# Altium project StarTopper.PrjPcb
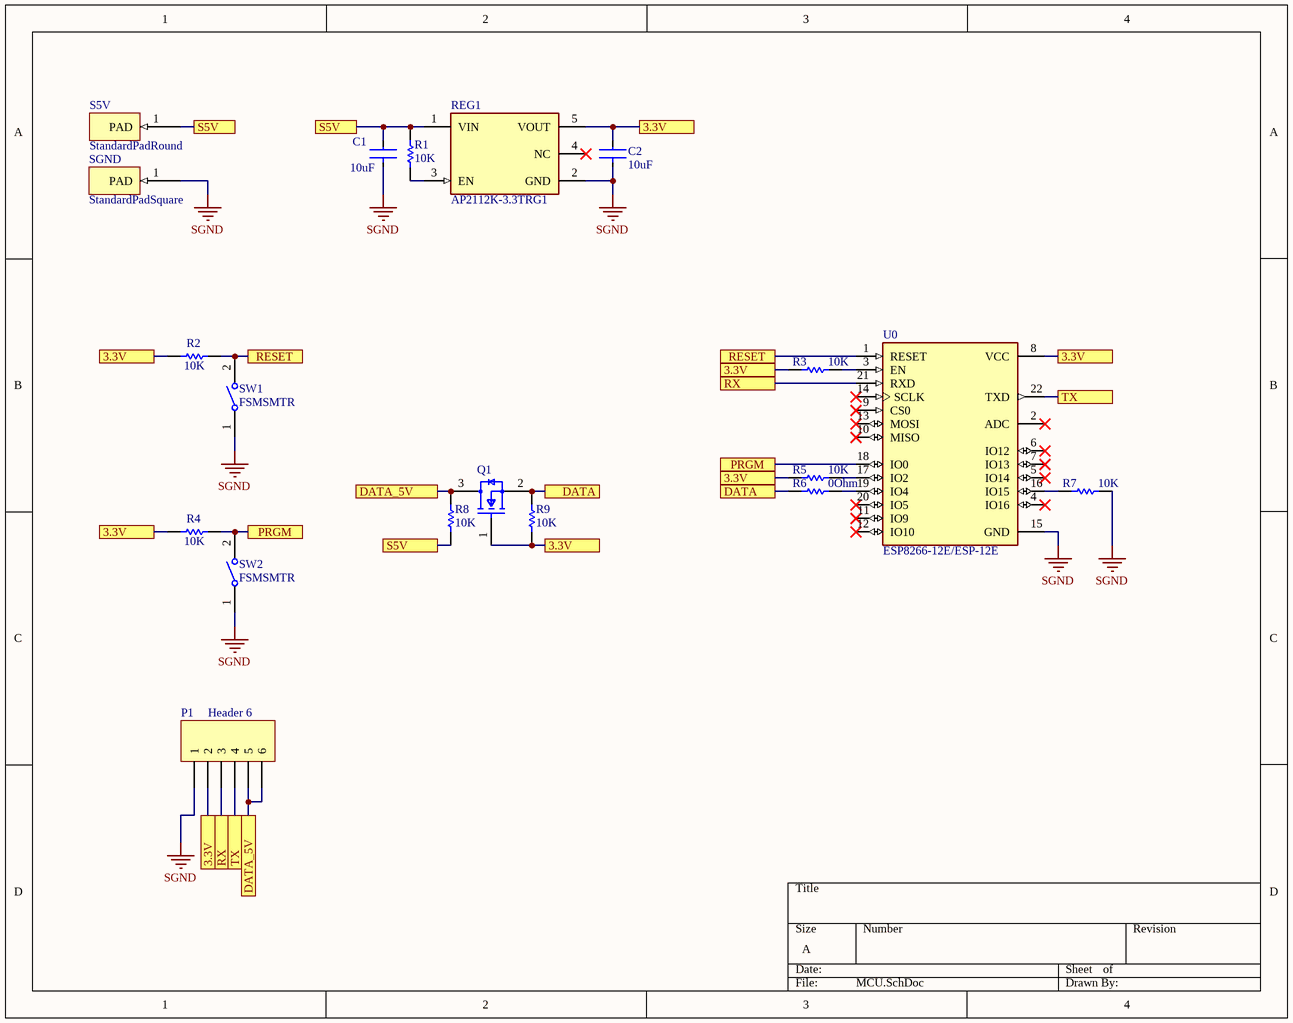
[diagram p0: MCU.SchDoc]
2 sheets, 86 parts. Net scope: flat (ports and power ports of the same name join across sheets).
Board file: Star.PcbDoc
Sheets:
  MCU.SchDoc
  LEDs.SchDoc

## Sheet MCU.SchDoc
size A

### Parts
C1  value 10uF  [FP-CC0805-0_85-MFG]  (hidden comment: CC0805KKX7R6BB105)
C2  value 10uF  [FP-CC0805-0_85-MFG]  (hidden comment: CC0805KKX7R6BB105)
P1  Header 6  [HDR1X6]
Q1  BSS138  [FP-318-08-IPC_B]  (value not drawn)
R1  value 10K  [RESC2013X50X30LL20T20]  (hidden comment: CRCW08050000Z0EA)
R2  value 10K  [RESC2013X50X30LL20T20]  (hidden comment: CRCW08050000Z0EA)
R3  value 10K  [RESC2013X50X30LL20T20]  (hidden comment: CRCW08050000Z0EA)
R4  value 10K  [RESC2013X50X30LL20T20]  (hidden comment: CRCW08050000Z0EA)
R5  value 10K  [RESC2013X50X30LL20T20]  (hidden comment: CRCW08050000Z0EA)
R6  value 0Ohm  [RESC2013X50X30LL20T20]  (hidden comment: CRCW08050000Z0EA)
R7  value 10K  [RESC2013X50X30LL20T20]  (hidden comment: CRCW08050000Z0EA)
R8  10K  [RESC2013X50X30ML20T20]
R9  10K  [RESC2013X50X30ML20T20]
REG1  AP2112K-3.3TRG1  [FP-SOT25-IPC_A]
S5V  StandardPadRound  [StandardPadRound-Footprint-1]
SGND  StandardPadSquare  [StandardPadSquare-Footprint-1]
SW1  FSMSMTR  [TECO-FSMSMTR_V]
SW2  FSMSMTR  [TECO-FSMSMTR_V]
U0  ESP8266-12E/ESP-12E  [XCVR_ESP8266-12E%2FESP-12E]

### Ports
3.3V, DATA, DATA_5V, PRGM, RESET, RX, S5V, TX

### Nets
SGND: C1.1 C2.1 P1.1 R7.2 REG1.2(GND) SGND.1(PAD) SW1.1 SW2.1 U0.15(GND)
NetC1_2: C1.2 R1.2 R8.1 REG1.1(VIN) S5V.1(PAD) ; port S5V
NetC2_2: C2.2 P1.2 Q1.1(G) R2.1 R3.1 R4.1 R5.1 R9.1 REG1.5(VOUT) U0.8(VCC) ; port 3.3V
NetP1_3: P1.3 U0.21(RXD) ; port RX
NetP1_4: P1.4 U0.22(TXD) ; port TX
NetP1_5: P1.5 P1.6 Q1.3(D) R8.2 ; port DATA_5V
NetQ1_2: Q1.2(S) R6.1 R9.2 ; port DATA
NetR1_1: R1.1 REG1.3(EN)
NetR2_2: R2.2 SW1.2 U0.1(RESET) ; port RESET
NetR3_2: R3.2 U0.3(EN)
NetR4_2: R4.2 SW2.2 U0.18(IO0) ; port PRGM
NetR5_2: R5.2 U0.17(IO2)
NetR6_2: R6.2 U0.19(IO4)
NetR7_1: R7.1 U0.16(IO15)

Not connected (* = marked no-connect by the designer): REG1 4(NC)*; U0 2(ADC)* 4(IO16)* 5(IO14)* 6(IO12)* 7(IO13)* 9(CS0)* 10(MISO)* 11(IO9)* 12(IO10)* 13(MOSI)* 14(SCLK)* 20(IO5)*

### Library data of the parts
C1 C2 = CMP-03422-000182-1: CAP CER 1UF 10V X7R 0805; Manufacturer: Yageo; Material: Ceramic; Tolerance: 0.1; ComponentLink2URL: http://www.yageo.com/documents/recent/UPY-GPHC_Y5V_6.3V-to-50V_8.pdf; Automotive: No; Temperature Range Low: -30°C; Octopart: https://octopart.com/cc0805kkx7r6bb105-yageo-42522859; Temperature Characteristic: X7R; RoHS: TRUE; Voltage Rating: 10 V; Capacitance: 1 uF; Package: CC0805-0.85; Device Class L3: Ceramic Capacitors; Category: Cap; Mouser Description: Multilayer Ceramic Capacitors MLCC - SMD/SMT 1.0uF 10V X7R 10%; Temperature Range High: +85°C; Ipc Land Pattern Name: CAPC200125X85; Manufacturer Part Number: CC0805KKX7R6BB105; ComponentLink2Description: Datasheet; Temperature: -30°C to +85°C; Height: 0.95mm; Lead Free: Yes; Device Class L1: Passive Components; Device Class L2: Capacitors; Footprint Url: http://www.yageo.com/exep/pages/download/literatures/UPY-C_GEN_24.pdf; Digikey Description: CAP CER 1UF 10V X7R 0805
P1 = CMP-049-0107-1: Header, 6-Pin; Signal Integrity: Connector; LatestRevisionNote: Re-released for DXP Platform.; LatestRevisionDate: 17-Jul-2002; Design Item ID: Header 6; Pin Count: 6; Publisher: Altium Limited; Source: Miscellaneous Connectors.SchLib; Component Type: Standard
Q1 = CMP-07173-000101-1: MOSFET N-CH 50V 220MA SOT-23; Turn-Off Delay Time: 20ns; Element Configuration: Single; Rds On Max: 3.5R; Gate to Source Voltage (Vgs): 20V; Threshold Voltage: 1.3V; Number of Elements: 1; Power Dissipation: 360mW; Rise Time: 9ns; Turn-On Delay Time: 2.5ns; Input Capacitance: 27pF; On-State Resistance: 6R; Lead Free: Lead Free; Length: 2.92mm; Width: 1.3mm; Drain to Source Breakdown Voltage: 50V; Min Operating Temperature: -55°C; REACH SVHC: No SVHC; Packaging: Tape and Reel; Radiation Hardening: No; Height: 0.93mm; Drain to Source Voltage (Vdss): 50V; Current Rating: 220mA; Voltage Rating (DC): 50V; Weight: 0.03g; Continuous Drain Current (ID): 220mA; Number of Pins: 3; Nominal Vgs: 1.3V; Max Power Dissipation: 360mW; Fall Time: 9ns; Drain to Source Resistance: 3.5R; Contact Plating: Tin; Case/Package: SOT-23; Package Quantity: 1; Dual Supply Voltage: 50V; Mount: Surface Mount; Termination: SMD/SMT; Max Operating Temperature: 150°C
R1-R7 = CMP-2001-04896-1: 0805; Manufacturer: Vishay Dale; Part Number: CRCW08050000Z0EA
R8 R9 = CMP-2001-03735-1: Part Number: CRCW0805270RFKEA; Manufacturer: Vishay Dale
REG1 = CMP-12756-000035-1: IC REG LINEAR 3.3V 600MA SOT25; Number of Regulators: 1; Output Type: Fixed; Polarity: Positive; Min Input Voltage: 2.5V; Max Input Voltage: 6V; Accuracy: 1.5%; Quiescent Current: 55uA; Dropout Voltage: 250mV; Min Operating Temperature: -40°C; Length: 3.1mm; Output Current: 600mA; Max Operating Temperature: 85°C; Package Quantity: 1; Output Voltage: 3.3V; Width: 1.7mm; Number of Outputs: 1; Packaging: Tape and Reel; Height: 1.3mm; Lead Free: Lead Free; Max Output Current: 600mA; Case/Package: SOT-23-5; Mount: Surface Mount; Number of Pins: 5
S5V = CMP-000003-1: 1.9mm x 1.9mm round pad with a 1mm hole
SGND = CMP-000004-1: 1.9mm X 1.9mm square pad with 1mm hole
SW1 SW2 = CMP-2000-07501-1: FSMSM Push Button Switch, 50 mA, -35 to 85 degC, 2-Pin SMD, RoHS, Tape and Reel; Manufacturer: TE Connectivity; Voltage Rating (DC): 24V; Electrical Life: 20000Cycles; Operating Force: 180gf; Switch Travel: 0.25mm; Contact Current Rating: 50mA; Case\/Package: SMD/SMT; Actuator Length: 1.07mm; Throw Configuration: SPST; Actuator Material: Polyamide; Contact Resistance: 100mOhm; Illumination Type: Illuminated; Max Voltage Rating (DC): 12V; Manufacturer URL: http://www.te.com/; Lead Free: LeadFree; Packaging: TapeandReel; Min Operating Temperature: -35degC; Mechanical Life: 20000Cycles; Mount: SurfaceMount; REACH SVHC: Unknown; Package Quantity: 1800; Package Reference: FSMSMTR; RoHSCompliant: true; Max Operating Temperature: 85degC; Orientation: Straight; ELV: Compliant; Datasheet URL: http://www.te.com/commerce/DocumentDelivery/DDEController?Action=showdoc&DocId=Customer+Drawing%7F1437566-3%7FC2%7Fpdf%7FEnglish%7FENG_CD_1437566-3_C2_1437566_3_1_c.dwg.pdf%7F1437566-4; Package Description: 2-Pin Surface Mount Device, Body 6 x 3.5 mm, Pitch 9.19 mm; Current Rating: 50mA; Contact Plating: Silver; Termination: GullWing; Datasheet Version: Rev. C2, 08/2014; Contact Material: Brass; Mounting Technology: SurfaceMount
U0 = CMP-052-0000-2: This WiFi module has a 32-bit MCU micro and clock speeds supporting 80 MHz or 160 MHz. Supports the RTOS and integrated Wi-Fi MAC/BB/RF/PA/LNA, and has an on-board antenna.; MF: AI-Thinker; Design Item ID: ESP8266-12E/ESP-12E; Availability: Unavailable; Source: SnapEDAsch.SchLib; SnapEDA_Link: https://www.snapeda.com/parts/ESP8266-12E/ESP-12E/AI-Thinker/view-part/106414/?ref=snap; Value: *; Component Type: Standard; Price: None; Pin Count: 22; Package: None; MP: ESP8266-12E/ESP-12E

## Sheet LEDs.SchDoc
size B
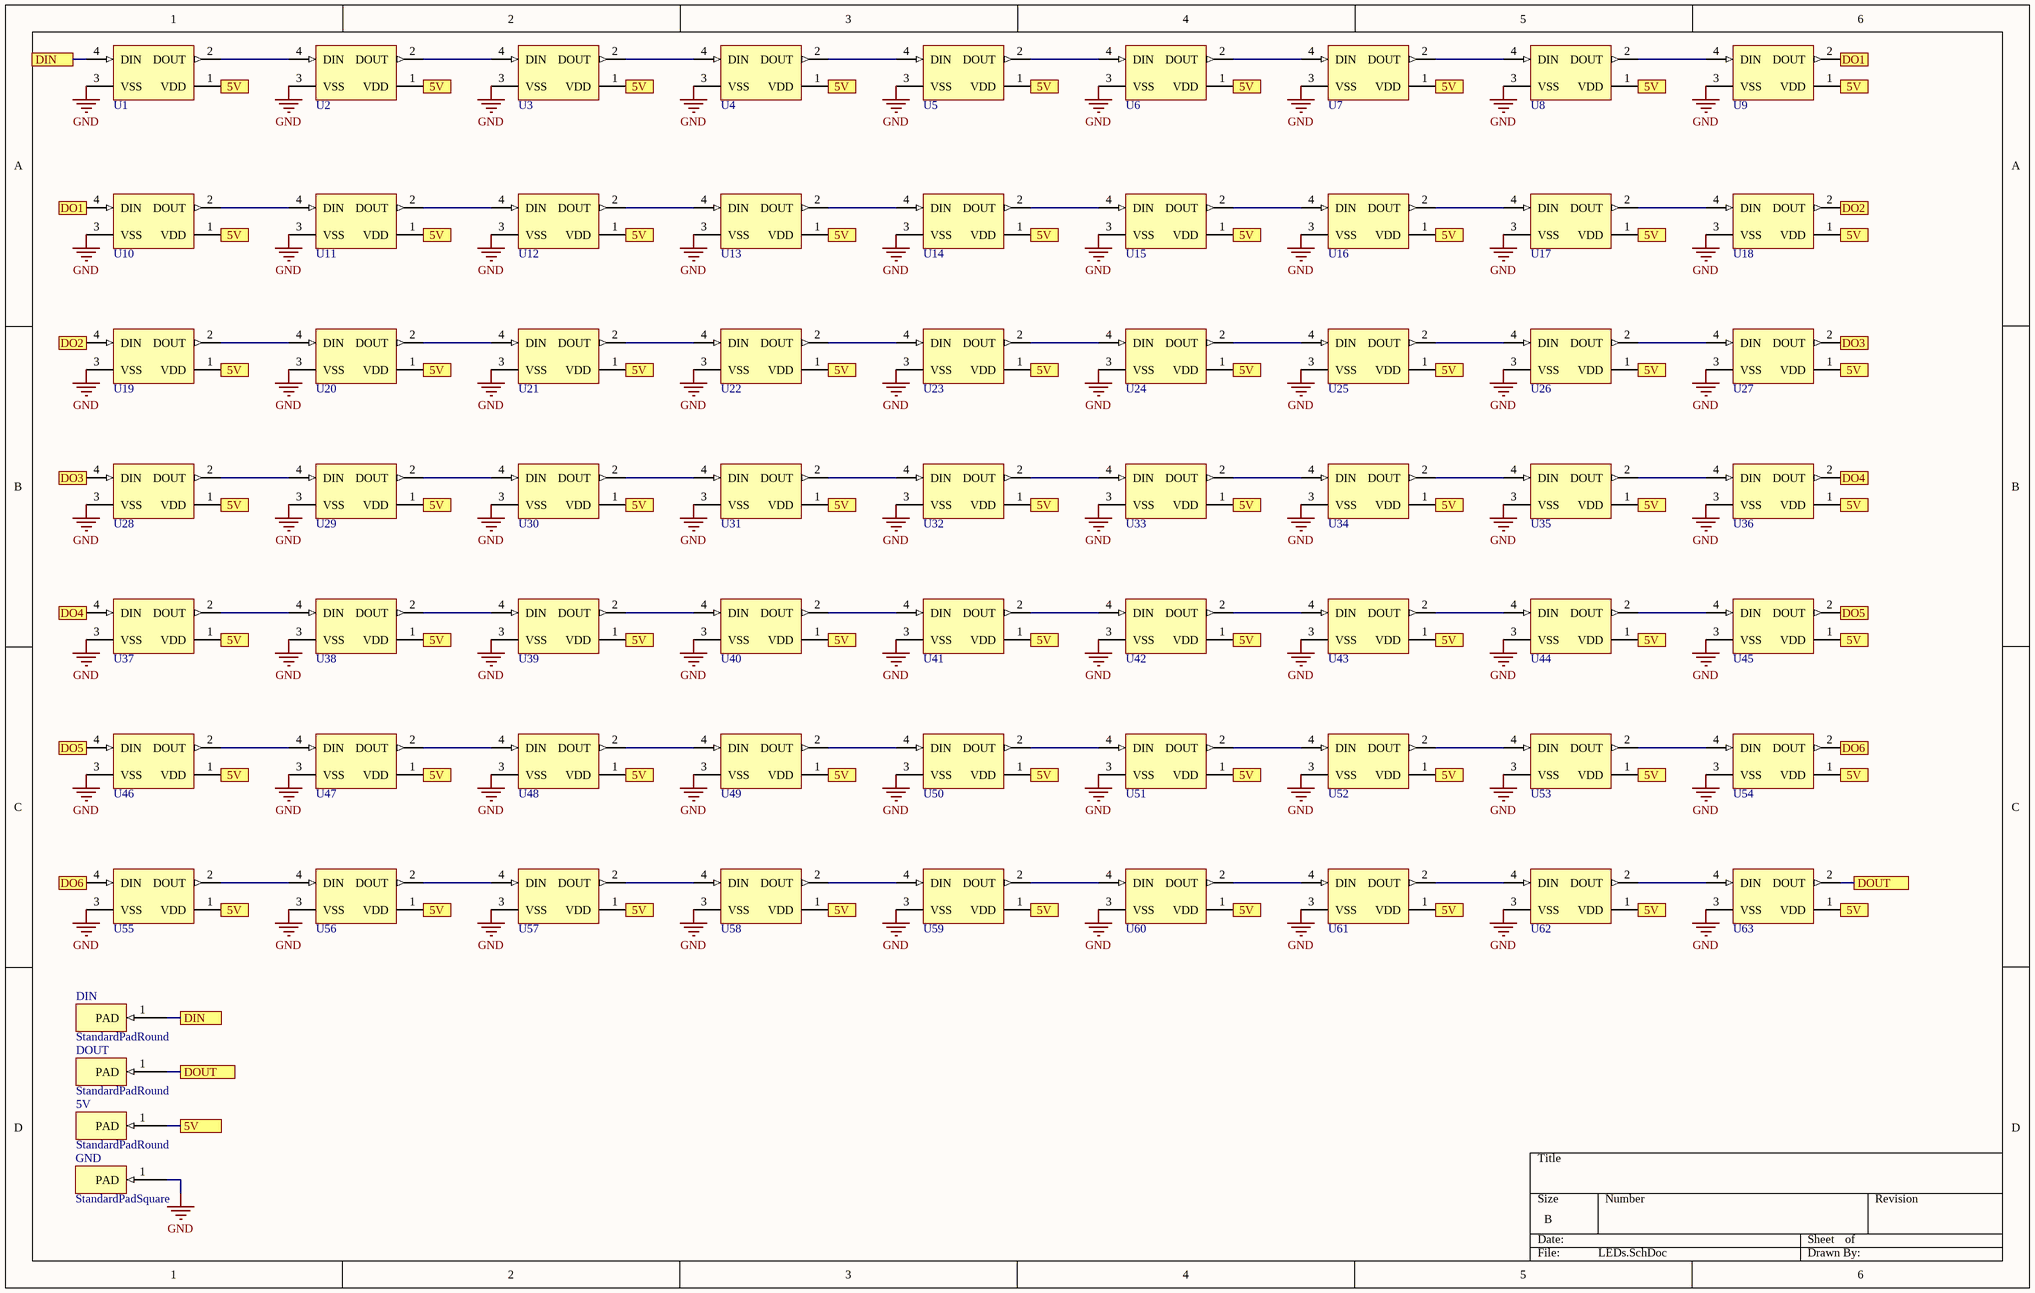
[diagram p1: LEDs.SchDoc]

### Parts
5V  StandardPadRound  [StandardPadRound-Footprint-1]
DIN  StandardPadRound  [StandardPadRound-Footprint-1]
DOUT  StandardPadRound  [StandardPadRound-Footprint-1]
GND  StandardPadSquare  [StandardPadSquare-Footprint-1]
U1  WS2812B  [WS2812B-Footprint-1]  (value not drawn)
U2  WS2812B  [WS2812B-Footprint-1]  (value not drawn)
U3  WS2812B  [WS2812B-Footprint-1]  (value not drawn)
U4  WS2812B  [WS2812B-Footprint-1]  (value not drawn)
U5  WS2812B  [WS2812B-Footprint-1]  (value not drawn)
U6  WS2812B  [WS2812B-Footprint-1]  (value not drawn)
U7  WS2812B  [WS2812B-Footprint-1]  (value not drawn)
U8  WS2812B  [WS2812B-Footprint-1]  (value not drawn)
U9  WS2812B  [WS2812B-Footprint-1]  (value not drawn)
U10  WS2812B  [WS2812B-Footprint-1]  (value not drawn)
U11  WS2812B  [WS2812B-Footprint-1]  (value not drawn)
U12  WS2812B  [WS2812B-Footprint-1]  (value not drawn)
U13  WS2812B  [WS2812B-Footprint-1]  (value not drawn)
U14  WS2812B  [WS2812B-Footprint-1]  (value not drawn)
U15  WS2812B  [WS2812B-Footprint-1]  (value not drawn)
U16  WS2812B  [WS2812B-Footprint-1]  (value not drawn)
U17  WS2812B  [WS2812B-Footprint-1]  (value not drawn)
U18  WS2812B  [WS2812B-Footprint-1]  (value not drawn)
U19  WS2812B  [WS2812B-Footprint-1]  (value not drawn)
U20  WS2812B  [WS2812B-Footprint-1]  (value not drawn)
U21  WS2812B  [WS2812B-Footprint-1]  (value not drawn)
U22  WS2812B  [WS2812B-Footprint-1]  (value not drawn)
U23  WS2812B  [WS2812B-Footprint-1]  (value not drawn)
U24  WS2812B  [WS2812B-Footprint-1]  (value not drawn)
U25  WS2812B  [WS2812B-Footprint-1]  (value not drawn)
U26  WS2812B  [WS2812B-Footprint-1]  (value not drawn)
U27  WS2812B  [WS2812B-Footprint-1]  (value not drawn)
U28  WS2812B  [WS2812B-Footprint-1]  (value not drawn)
U29  WS2812B  [WS2812B-Footprint-1]  (value not drawn)
U30  WS2812B  [WS2812B-Footprint-1]  (value not drawn)
U31  WS2812B  [WS2812B-Footprint-1]  (value not drawn)
U32  WS2812B  [WS2812B-Footprint-1]  (value not drawn)
U33  WS2812B  [WS2812B-Footprint-1]  (value not drawn)
U34  WS2812B  [WS2812B-Footprint-1]  (value not drawn)
U35  WS2812B  [WS2812B-Footprint-1]  (value not drawn)
U36  WS2812B  [WS2812B-Footprint-1]  (value not drawn)
U37  WS2812B  [WS2812B-Footprint-1]  (value not drawn)
U38  WS2812B  [WS2812B-Footprint-1]  (value not drawn)
U39  WS2812B  [WS2812B-Footprint-1]  (value not drawn)
U40  WS2812B  [WS2812B-Footprint-1]  (value not drawn)
U41  WS2812B  [WS2812B-Footprint-1]  (value not drawn)
U42  WS2812B  [WS2812B-Footprint-1]  (value not drawn)
U43  WS2812B  [WS2812B-Footprint-1]  (value not drawn)
U44  WS2812B  [WS2812B-Footprint-1]  (value not drawn)
U45  WS2812B  [WS2812B-Footprint-1]  (value not drawn)
U46  WS2812B  [WS2812B-Footprint-1]  (value not drawn)
U47  WS2812B  [WS2812B-Footprint-1]  (value not drawn)
U48  WS2812B  [WS2812B-Footprint-1]  (value not drawn)
U49  WS2812B  [WS2812B-Footprint-1]  (value not drawn)
U50  WS2812B  [WS2812B-Footprint-1]  (value not drawn)
U51  WS2812B  [WS2812B-Footprint-1]  (value not drawn)
U52  WS2812B  [WS2812B-Footprint-1]  (value not drawn)
U53  WS2812B  [WS2812B-Footprint-1]  (value not drawn)
U54  WS2812B  [WS2812B-Footprint-1]  (value not drawn)
U55  WS2812B  [WS2812B-Footprint-1]  (value not drawn)
U56  WS2812B  [WS2812B-Footprint-1]  (value not drawn)
U57  WS2812B  [WS2812B-Footprint-1]  (value not drawn)
U58  WS2812B  [WS2812B-Footprint-1]  (value not drawn)
U59  WS2812B  [WS2812B-Footprint-1]  (value not drawn)
U60  WS2812B  [WS2812B-Footprint-1]  (value not drawn)
U61  WS2812B  [WS2812B-Footprint-1]  (value not drawn)
U62  WS2812B  [WS2812B-Footprint-1]  (value not drawn)
U63  WS2812B  [WS2812B-Footprint-1]  (value not drawn)

### Ports
5V, DIN, DO1, DO2, DO3, DO4, DO5, DO6, DOUT

### Nets
GND: GND.1(PAD) U1.3(VSS) U2.3(VSS) U3.3(VSS) U4.3(VSS) U5.3(VSS) U6.3(VSS) U7.3(VSS) U8.3(VSS) U9.3(VSS) U10.3(VSS) U11.3(VSS) U12.3(VSS) U13.3(VSS) U14.3(VSS) U15.3(VSS) U16.3(VSS) U17.3(VSS) U18.3(VSS) U19.3(VSS) U20.3(VSS) U21.3(VSS) U22.3(VSS) U23.3(VSS) U24.3(VSS) U25.3(VSS) U26.3(VSS) U27.3(VSS) U28.3(VSS) U29.3(VSS) U30.3(VSS) U31.3(VSS) U32.3(VSS) U33.3(VSS) U34.3(VSS) U35.3(VSS) U36.3(VSS) U37.3(VSS) U38.3(VSS) U39.3(VSS) U40.3(VSS) U41.3(VSS) U42.3(VSS) U43.3(VSS) U44.3(VSS) U45.3(VSS) U46.3(VSS) U47.3(VSS) U48.3(VSS) U49.3(VSS) U50.3(VSS) U51.3(VSS) U52.3(VSS) U53.3(VSS) U54.3(VSS) U55.3(VSS) U56.3(VSS) U57.3(VSS) U58.3(VSS) U59.3(VSS) U60.3(VSS) U61.3(VSS) U62.3(VSS) U63.3(VSS)
Net5V_1: 5V.1(PAD) U1.1(VDD) U2.1(VDD) U3.1(VDD) U4.1(VDD) U5.1(VDD) U6.1(VDD) U7.1(VDD) U8.1(VDD) U9.1(VDD) U10.1(VDD) U11.1(VDD) U12.1(VDD) U13.1(VDD) U14.1(VDD) U15.1(VDD) U16.1(VDD) U17.1(VDD) U18.1(VDD) U19.1(VDD) U20.1(VDD) U21.1(VDD) U22.1(VDD) U23.1(VDD) U24.1(VDD) U25.1(VDD) U26.1(VDD) U27.1(VDD) U28.1(VDD) U29.1(VDD) U30.1(VDD) U31.1(VDD) U32.1(VDD) U33.1(VDD) U34.1(VDD) U35.1(VDD) U36.1(VDD) U37.1(VDD) U38.1(VDD) U39.1(VDD) U40.1(VDD) U41.1(VDD) U42.1(VDD) U43.1(VDD) U44.1(VDD) U45.1(VDD) U46.1(VDD) U47.1(VDD) U48.1(VDD) U49.1(VDD) U50.1(VDD) U51.1(VDD) U52.1(VDD) U53.1(VDD) U54.1(VDD) U55.1(VDD) U56.1(VDD) U57.1(VDD) U58.1(VDD) U59.1(VDD) U60.1(VDD) U61.1(VDD) U62.1(VDD) U63.1(VDD) ; port 5V
NetDIN_1: DIN.1(PAD) U1.4(DIN) ; port DIN
NetDOUT_1: DOUT.1(PAD) U63.2(DOUT) ; port DOUT
NetU1_2: U1.2(DOUT) U2.4(DIN)
NetU2_2: U2.2(DOUT) U3.4(DIN)
NetU3_2: U3.2(DOUT) U4.4(DIN)
NetU4_2: U4.2(DOUT) U5.4(DIN)
NetU5_2: U5.2(DOUT) U6.4(DIN)
NetU6_2: U6.2(DOUT) U7.4(DIN)
NetU7_2: U7.2(DOUT) U8.4(DIN)
NetU8_2: U8.2(DOUT) U9.4(DIN)
NetU9_2: U9.2(DOUT) U10.4(DIN) ; port DO1
NetU10_2: U10.2(DOUT) U11.4(DIN)
NetU11_2: U11.2(DOUT) U12.4(DIN)
NetU12_2: U12.2(DOUT) U13.4(DIN)
NetU13_2: U13.2(DOUT) U14.4(DIN)
NetU14_2: U14.2(DOUT) U15.4(DIN)
NetU15_2: U15.2(DOUT) U16.4(DIN)
NetU16_2: U16.2(DOUT) U17.4(DIN)
NetU17_2: U17.2(DOUT) U18.4(DIN)
NetU18_2: U18.2(DOUT) U19.4(DIN) ; port DO2
NetU19_2: U19.2(DOUT) U20.4(DIN)
NetU20_2: U20.2(DOUT) U21.4(DIN)
NetU21_2: U21.2(DOUT) U22.4(DIN)
NetU22_2: U22.2(DOUT) U23.4(DIN)
NetU23_2: U23.2(DOUT) U24.4(DIN)
NetU24_2: U24.2(DOUT) U25.4(DIN)
NetU25_2: U25.2(DOUT) U26.4(DIN)
NetU26_2: U26.2(DOUT) U27.4(DIN)
NetU27_2: U27.2(DOUT) U28.4(DIN) ; port DO3
NetU28_2: U28.2(DOUT) U29.4(DIN)
NetU29_2: U29.2(DOUT) U30.4(DIN)
NetU30_2: U30.2(DOUT) U31.4(DIN)
NetU31_2: U31.2(DOUT) U32.4(DIN)
NetU32_2: U32.2(DOUT) U33.4(DIN)
NetU33_2: U33.2(DOUT) U34.4(DIN)
NetU34_2: U34.2(DOUT) U35.4(DIN)
NetU35_2: U35.2(DOUT) U36.4(DIN)
NetU36_2: U36.2(DOUT) U37.4(DIN) ; port DO4
NetU37_2: U37.2(DOUT) U38.4(DIN)
NetU38_2: U38.2(DOUT) U39.4(DIN)
NetU39_2: U39.2(DOUT) U40.4(DIN)
NetU40_2: U40.2(DOUT) U41.4(DIN)
NetU41_2: U41.2(DOUT) U42.4(DIN)
NetU42_2: U42.2(DOUT) U43.4(DIN)
NetU43_2: U43.2(DOUT) U44.4(DIN)
NetU44_2: U44.2(DOUT) U45.4(DIN)
NetU45_2: U45.2(DOUT) U46.4(DIN) ; port DO5
NetU46_2: U46.2(DOUT) U47.4(DIN)
NetU47_2: U47.2(DOUT) U48.4(DIN)
NetU48_2: U48.2(DOUT) U49.4(DIN)
NetU49_2: U49.2(DOUT) U50.4(DIN)
NetU50_2: U50.2(DOUT) U51.4(DIN)
NetU51_2: U51.2(DOUT) U52.4(DIN)
NetU52_2: U52.2(DOUT) U53.4(DIN)
NetU53_2: U53.2(DOUT) U54.4(DIN)
NetU54_2: U54.2(DOUT) U55.4(DIN) ; port DO6
NetU55_2: U55.2(DOUT) U56.4(DIN)
NetU56_2: U56.2(DOUT) U57.4(DIN)
NetU57_2: U57.2(DOUT) U58.4(DIN)
NetU58_2: U58.2(DOUT) U59.4(DIN)
NetU59_2: U59.2(DOUT) U60.4(DIN)
NetU60_2: U60.2(DOUT) U61.4(DIN)
NetU61_2: U61.2(DOUT) U62.4(DIN)
NetU62_2: U62.2(DOUT) U63.4(DIN)

### Library data of the parts
5V DIN DOUT = CMP-000003-1: 1.9mm x 1.9mm round pad with a 1mm hole
GND = CMP-000004-1: 1.9mm X 1.9mm square pad with 1mm hole
U1-U63 = CMP-007-00035-2: Intelligent Control LED Integrated Light Source, 3.5 to 5.3 V, -25 to 80 degC, 4-Pin SMD, RoHS, Bulk; Manufacturer: Adafruit Industries; Mounting Technology: SM; Case/Package: WS2812B; Datasheet URL: https://cdn-shop.adafruit.com/datasheets/WS2812B.pdf; Manufacturer URL: https://www.adafruit.com/; Package Reference: WS2812B; Package Description: 4-Pin Surface Mount Device, Body 5 x 5 mm, Pitch 3.3 mm; RoHS Compliant: False; Datasheet Version: May-13